# Altium project 帆板.PrjPCB
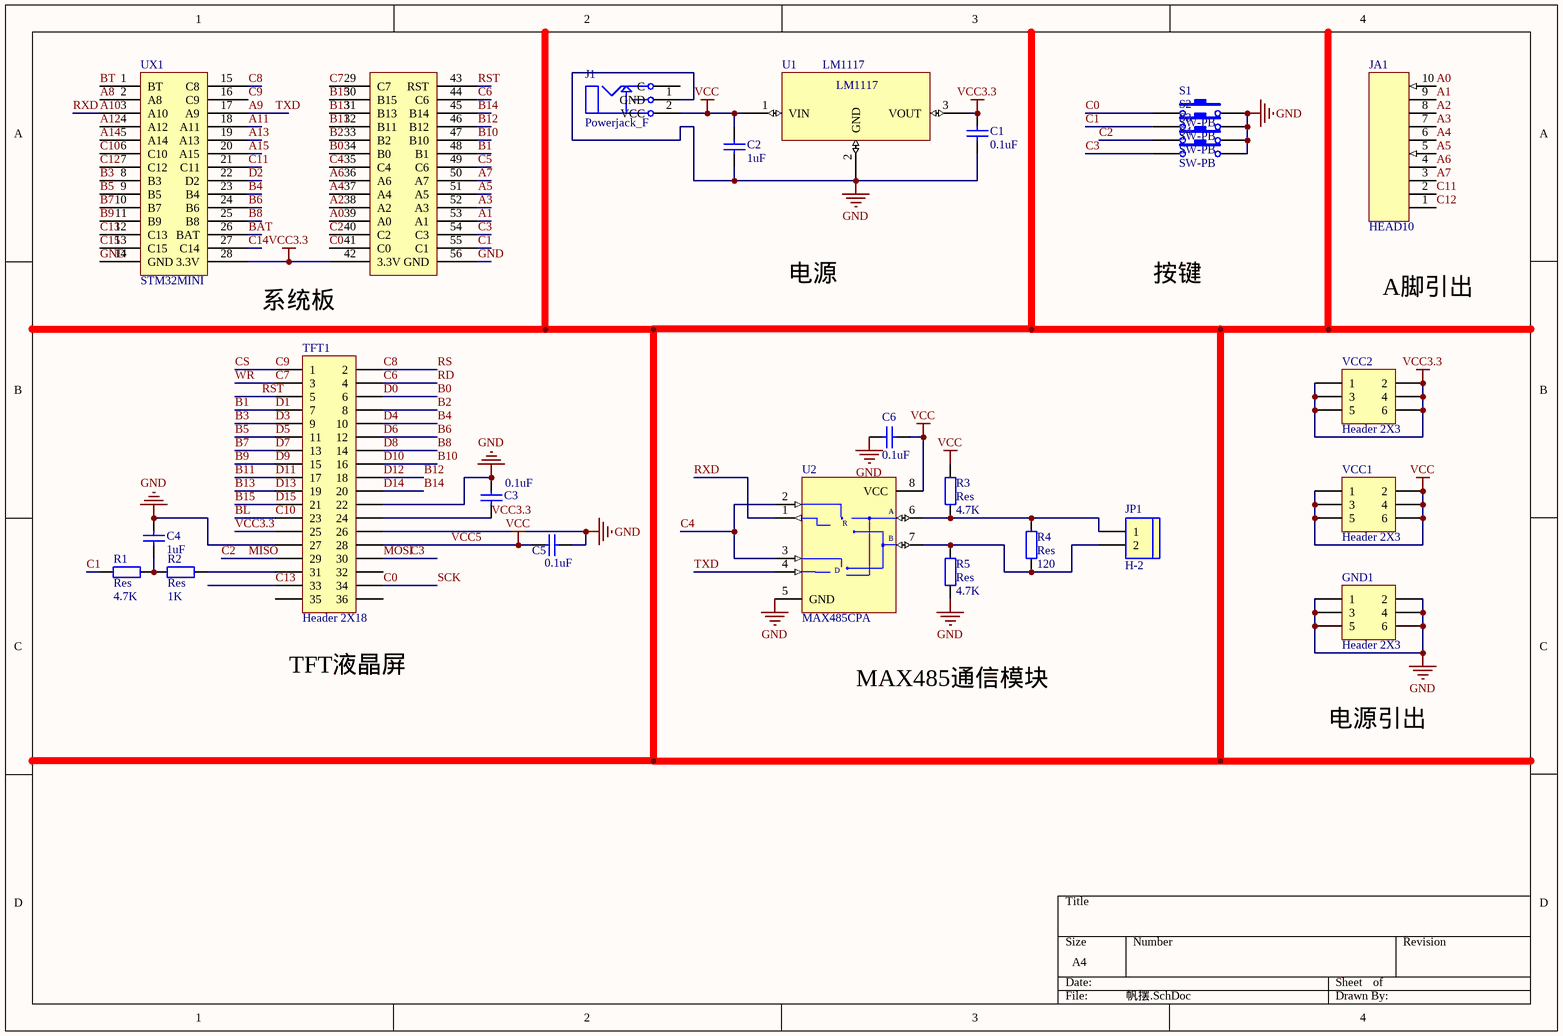
[diagram p0: 帆摆.SchDoc]
1 sheet, 25 parts. Net scope: global (net labels, ports and power ports of the same name join across sheets).
Board file: 32-帆板.PcbDoc

## Sheet 帆摆.SchDoc
size A4

### Parts
C1  value 0.1uF  [CC1005-0402]  (hidden comment: CAP)
C2  value 1uF  [CC1005-0402]  (hidden comment: CAP)
C3  value 0.1uF  [CC1005-0402]  (hidden comment: CAP)
C4  value 1uF  [CC1005-0402]  (hidden comment: CAP)
C5  value 0.1uF  [CC1005-0402]  (hidden comment: CAP)
C6  value 0.1uF  [CC1005-0402]  (hidden comment: CAP)
GND1  Header 2X3  [HDR2-3]
J1  Powerjack_F  [PWJ-2/3]
JA1  HEAD10  [HEAD10M]
JP1  H-2  [H-2/2-T]
R1  Res  value 4.7K  [R2012-0805]
R2  Res  value 1K  [R2012-0805]
R3  Res  value 4.7K  [R2012-0805]
R4  Res  value 120  [R2012-0805]
R5  Res  value 4.7K  [R2012-0805]
S1  SW-PB  [SW-PB-4S]
S2  SW-PB  [SW-PB-4S]
S3  SW-PB  [SW-PB-4S]
S4  SW-PB  [SW-PB-4S]
TFT1  Header 2X18  [HDR2-18]
U1  LM1117  [DSO-G3/P2.3]
U2  MAX485CPA  [DIP8]
UX1  STM32MINI  [STM32---MIN---64]
VCC1  Header 2X3  [HDR2-3]
VCC2  Header 2X3  [HDR2-3]

### Nets
GND: C1.1 C2.1 C3.2 C4.2 C5.1 C6.1 GND1.1 GND1.2 GND1.3 GND1.4 GND1.5 GND1.6 J1.1(GND) R5.1 S1.2 S2.2 S3.2 S4.2 TFT1.22 TFT1.26 TFT1.27 U1.2(GND) U2.5(GND) UX1.14(GND) UX1.56(GND)
VCC3.3: C1.2 C3.1 TFT1.24 TFT1.25 U1.3(VOUT) UX1.28(3.3V) UX1.42(3.3V) VCC2.1 VCC2.2 VCC2.3 VCC2.4 VCC2.5 VCC2.6
VCC5: C2.2 C5.2 C6.2 J1.2(VCC) R3.2 TFT1.28 U1.1(VIN) U2.8(VCC) VCC1.1 VCC1.2 VCC1.3 VCC1.4 VCC1.5 VCC1.6  [also labelled VCC]
A0: JA1.10 UX1.39(A0)
A1: JA1.9 UX1.53(A1)
A2: JA1.8 UX1.38(A2)
A3: JA1.7 UX1.52(A3)
A4: JA1.6 UX1.37(A4)
A5: JA1.5 UX1.51(A5)
A6: JA1.4 UX1.36(A6)
A7: JA1.3 UX1.50(A7)
A8: UX1.2(A8)
A9: U2.4(DI) UX1.17(A9)  [also labelled TXD]
A10: U2.1(RO) UX1.3(A10)  [also labelled RXD]
A11: UX1.18(A11)
A12: UX1.4(A12)
A13: UX1.19(A13)
A14: UX1.5(A14)
A15: UX1.20(A15)
B0: TFT1.6 UX1.34(B0)  [also labelled D0]
B1: TFT1.7 UX1.48(B1)  [also labelled D1]
B2: TFT1.8 UX1.33(B2)
B3: TFT1.9 UX1.8(B3)  [also labelled D3]
B4: TFT1.10 UX1.23(B4)  [also labelled D4]
B5: TFT1.11 UX1.9(B5)  [also labelled D5]
B6: TFT1.12 UX1.24(B6)  [also labelled D6]
B7: TFT1.13 UX1.10(B7)  [also labelled D7]
B8: TFT1.14 UX1.25(B8)  [also labelled D8]
B9: TFT1.15 UX1.11(B9)  [also labelled D9]
B10: TFT1.16 UX1.47(B10)  [also labelled D10]
B11: TFT1.17 UX1.32(B11)  [also labelled D11]
B12: TFT1.18 UX1.46(B12)  [also labelled D12]
B13: TFT1.19 UX1.31(B13)  [also labelled D13]
B14: TFT1.20 UX1.45(B14)  [also labelled D14]
B15: TFT1.21 UX1.30(B15)  [also labelled D15]
BAT: UX1.26(BAT)
BL: TFT1.23 UX1.6(C10)  [also labelled C10]
BT: UX1.1(BT)
C0: S1.1 TFT1.34 UX1.41(C0)  [also labelled SCK]
C1: R1.1 S2.1 UX1.55(C1)
C2: S3.1 TFT1.29 UX1.40(C2)  [also labelled MISO]
C3: S4.1 TFT1.30 UX1.54(C3)  [also labelled MOSI]
C4: U2.2(~{RE}) U2.3(DE) UX1.35(C4)
C5: UX1.49(C6)
C6: TFT1.4 UX1.44(C6)  [also labelled RD]
C7: TFT1.3 UX1.29(C7)  [also labelled WR]
C8: TFT1.2 UX1.15(C8)  [also labelled RS]
C9: TFT1.1 UX1.16(C9)  [also labelled CS]
C11: JA1.2 UX1.21(C11)
C12: JA1.1 UX1.7(C12)
C13: TFT1.33 UX1.12(C13)
C14: UX1.27(C14)
C15: UX1.13(C15)
D2: UX1.22(D2)
RST: TFT1.5 UX1.43(RST)
NetC4_1: C4.1 R1.2 R2.1
NetJP1_1: JP1.1 R3.1 R4.2 U2.6(A)
NetJP1_2: JP1.2 R4.1 R5.2 U2.7(B)
NetR2_2: R2.2 TFT1.31

Not connected (* = marked no-connect by the designer): J1 3(C); TFT1 32 35 36

### Notes on the sheet
- Labels drawn without touching a wire or pin: A, A脚引出, B, MAX485通信模块, TFT液晶屏, 按键, 电源, 电源引出, 系统板
- (in symbol MAX485CPA) R; D

### Library data of the parts
C1-C6 = CAP: Capacitor; Manufacturer: Generic Components; Class: Passive; Published: 08/06/2000; Publisher: Altium Hobart Technology Centre; SubClass: Capacitor
GND1 VCC1 VCC2 = Header 2X3: Header, 3-Pin, Dual row; Manufacturer: Generic Components; Class: Connector
J1 = Powerjack_F: 2-Conductor Jack with 1 break contact; Manufacturer: Generic Components; Class: Connector
JA1 = HEAD10: Connector,10-pin; Class: Connector
JP1 = H-2: Header, 2-Pin; Manufacturer: Generic Components; Class: Connector
R1-R5 = Res: Resistor; Manufacturer: Generic Components; Class: Passive; Published: 08/06/2000; Publisher: Altium Hobart Technology Centre; SubClass: Resistor
S1-S4 = SW-PB: Switch; Manufacturer: Generic Components; Published: 1999
TFT1 = Header 2X18: Header, 18Pin, Dual row; Manufacturer: Generic Components; Class: Connector
U2 = MAX485CPA: Low-Power, Slew-Rate-Limited RS-485/RS-422 Transceiver; Manufacturer: Maxim; Class: Communication; Published: 16/01/2001; Publisher: Altium Hobart Technology Centre; SubClass: Transceiver
UX1 = STM32---MIN--64